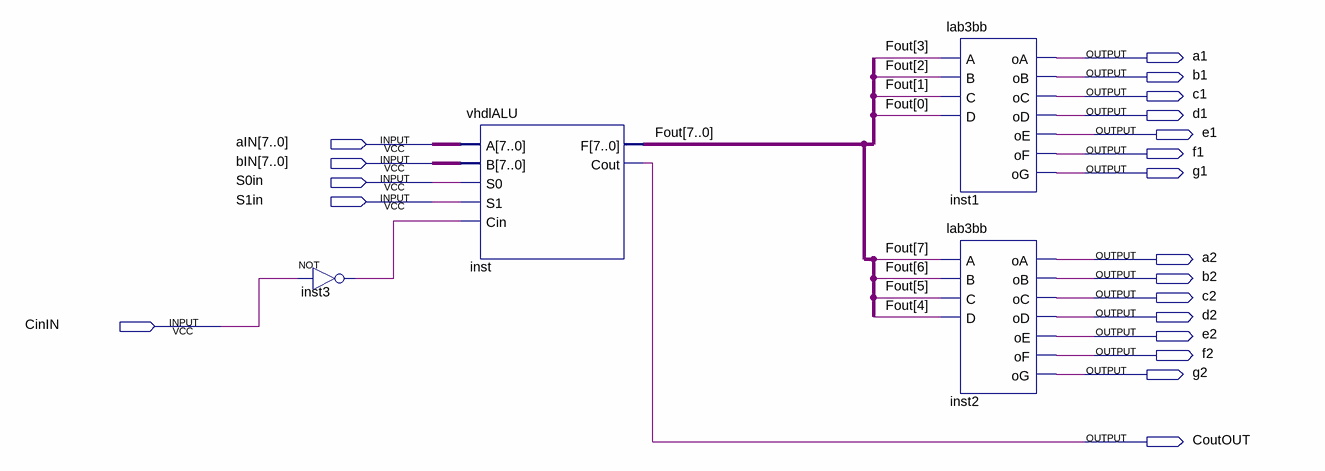
[diagram p0: schematic sheet]
// Quartus schematic lab6full.bdf as structural Verilog: 4 symbols, 20 pins
module lab6full (
  input  [7:0] aIN,
  input  [7:0] bIN,
  input  S0in,
  input  S1in,
  input  CinIN,
  output a1,
  output b1,
  output c1,
  output d1,
  output e1,
  output f1,
  output g1,
  output a2,
  output b2,
  output c2,
  output d2,
  output e2,
  output f2,
  output g2,
  output CoutOUT
);

  wire inst3_out;
  wire [7:0] Fout;

  not inst3 (inst3_out, CinIN);
  vhdlALU inst (.A(aIN), .B(bIN), .S0(S0in), .S1(S1in), .Cin(inst3_out), .F(Fout), .Cout(CoutOUT));
  lab3bb inst1 (
    .A(Fout[3]), .B(Fout[2]), .C(Fout[1]), .D(Fout[0]), .oA(a1), .oB(b1), .oC(c1), .oD(d1), .oE(e1), .oF(f1),
    .oG(g1));
  lab3bb inst2 (
    .A(Fout[7]), .B(Fout[6]), .C(Fout[5]), .D(Fout[4]), .oA(a2), .oB(b2), .oC(c2), .oD(d2), .oE(e2), .oF(f2),
    .oG(g2));
endmodule
